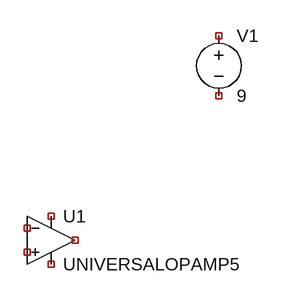
[diagram p0: schematic ebow.asc]
ebow.asc, the LTspice schematic file:
Version 4
SHEET 1 880 680
SYMBOL OpAmps\\UniversalOpAmp5 208 176 R0
SYMATTR InstName U1
SYMBOL voltage 432 -112 R0
WINDOW 123 0 0 Left 0
WINDOW 39 0 0 Left 0
SYMATTR InstName V1
SYMATTR Value 9

The netlist it stands for:
* ebow.asc
XU1 NC_01 NC_02 NC_03 NC_04 NC_05 level5 Avol=1Meg GBW=10Meg Phimargin=45 SlewPos=10Meg SlewNeg=10Meg En=0 Enk=0 In=0 Ink=0 Rcm=500Meg Ccm=1p Rdiff=500k Cdiff=2p Ro=1k Vos=0 Ibp=2n Ibn=1n Iq=1m Rail=0 Ilimit=25m  ; UNIVERSALOPAMP5, pins In+ In- V+ V- OUT
V1 NC_06 NC_07 9
.backanno
.end